# EAGLE schematic internal excitation- #7 (EAGLE 6.2)
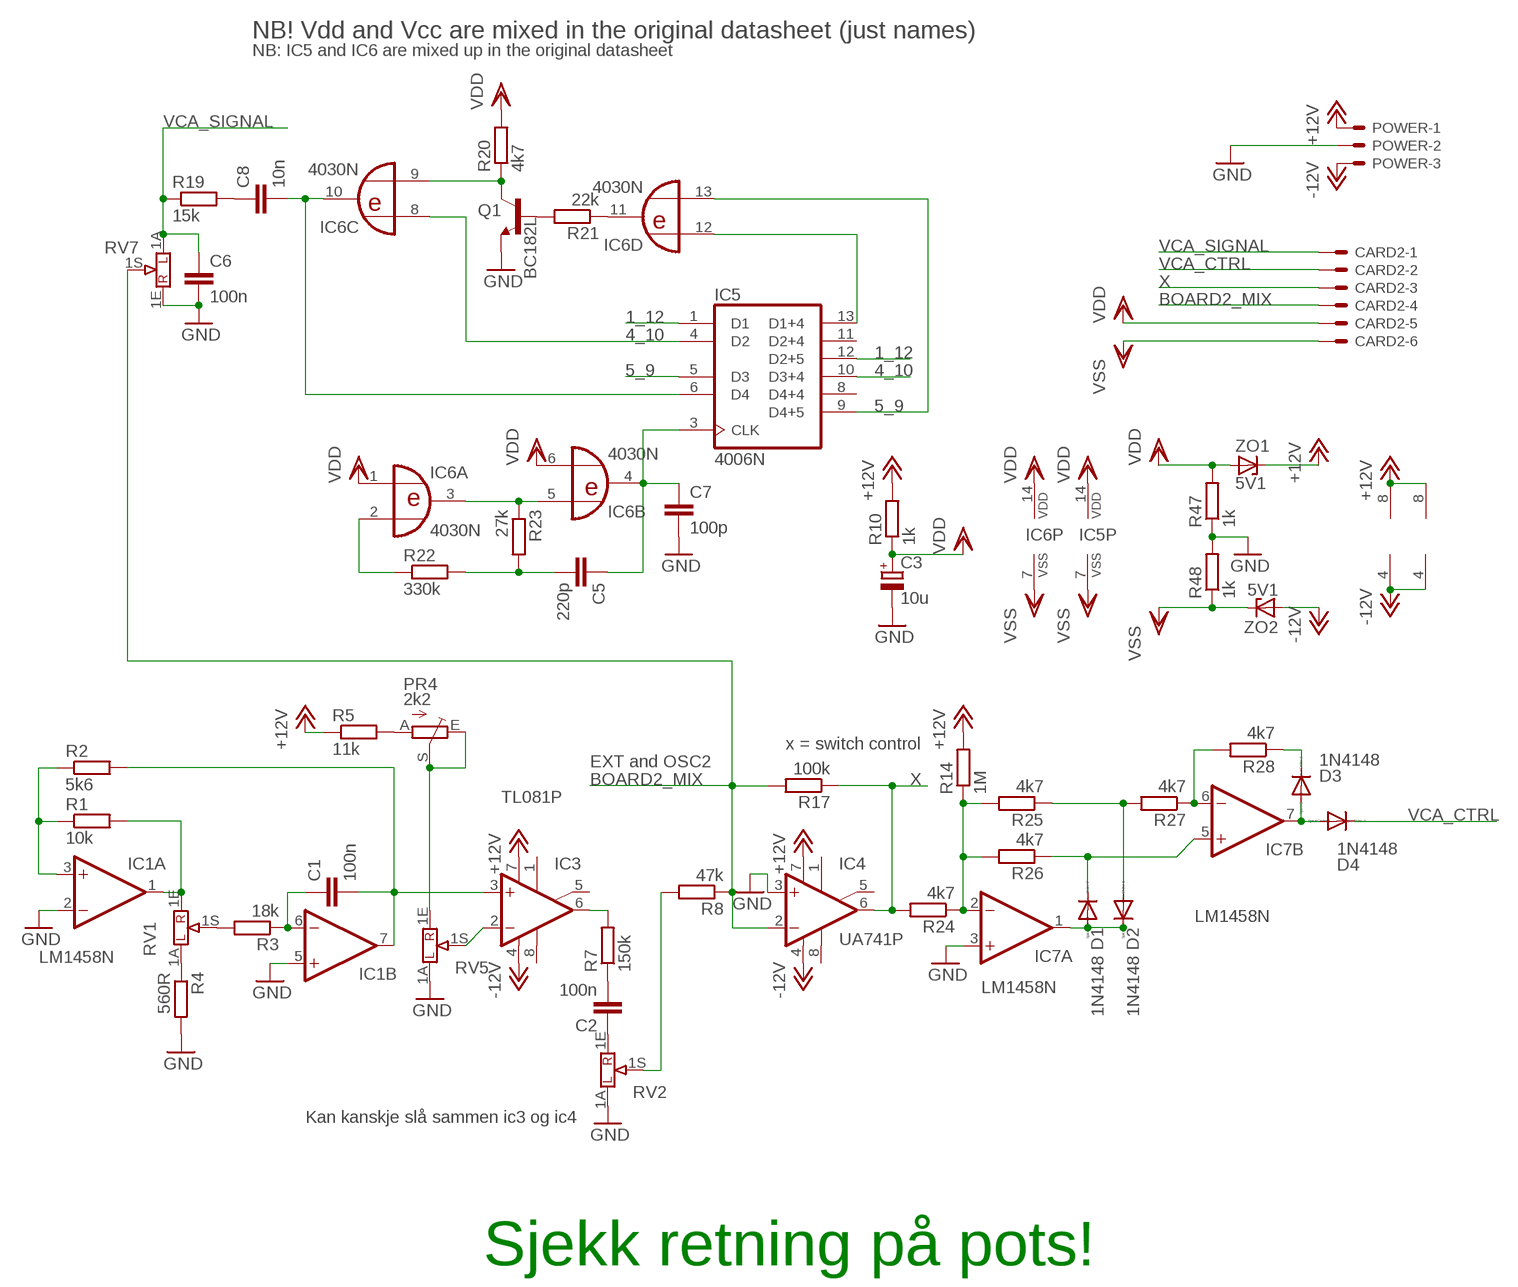
[diagram p0: schematic, sheet 1]

## Parts
C1  100n  C-EU050-025X075  [C050-025X075]
C2  100n  C-EU025-025X050  [C025-025X050]
C3  10u  CPOL-EUE2.5-5  [E2,5-5]
C5  220p  C-EU025-025X050  [C025-025X050]
C6  100n  C-EU025-025X050  [C025-025X050]
C7  100p  C-EU025-025X050  [C025-025X050]
C8  10n  C-EU050-025X075  [C050-025X075]
CARD2  22-23-2061  [22-23-2061]
D1  1N4148  1N4148DOJ35-5  [DO35-5J]
D2  1N4148  1N4148DOJ35-5  [DO35-5J]
D3  1N4148  1N4148DOJ35-5  [DO35-5J]
D4  1N4148  1N4148DOJ35-5  [DO35-5J]
IC1  LM1458N  [DIL08]
IC3  TL081P  [DIL08]
IC4  UA741P  [DIL08]
IC5  4006N  [DIL14]
IC6  4030N  [DIL14]
IC7  LM1458N  [DIL08]
POWER  KK-156-3  [KK-156-3]
PR4  2k2  TRIM_EU-CA9V  [CA9V]
Q1  BC182L  -NPN-TO92-ECB  [TO92-ECB]
R1  10k  R-EU_0207/7  [0207/7]
R2  5k6  R-EU_0207/7  [0207/7]
R3  18k  R-EU_0207/7  [0207/7]
R4  560R  R-EU_0207/7  [0207/7]
R5  11k  R-EU_0207/7  [0207/7]
R7  150k  R-EU_0207/7  [0207/7]
R8  47k  R-EU_0207/7  [0207/7]
R10  1k  R-EU_0207/7  [0207/7]
R14  1M  R-EU_0207/7  [0207/7]
R17  100k  R-EU_0207/7  [0207/7]
R19  15k  R-EU_0207/7  [0207/7]
R20  4k7  R-EU_0207/7  [0207/7]
R21  22k  R-EU_0207/7  [0207/7]
R22  330k  R-EU_0207/7  [0207/7]
R23  27k  R-EU_0207/7  [0207/7]
R24  4k7  R-EU_0207/7  [0207/7]
R25  4k7  R-EU_0207/7  [0207/7]
R26  4k7  R-EU_0207/7  [0207/7]
R27  4k7  R-EU_0207/7  [0207/7]
R28  4k7  R-EU_0207/7  [0207/7]
R47  1k  R-EU_0207/7  [0207/7]
R48  1k  R-EU_0207/7  [0207/7]
RV1  10k log  POT16_W_BRACKET""  [POT16_W_BRACKET]
RV2  10k log  POT16_W_BRACKET""  [POT16_W_BRACKET]
RV5  10k  POT16_W_BRACKET""  [POT16_W_BRACKET]
RV7  10k  POT16_W_BRACKET""  [POT16_W_BRACKET]
ZO1  5V1  ZENER-DIODEZD-5  [ZDIO-5]
ZO2  5V1  ZENER-DIODEZD-5  [ZDIO-5]

## Nets
1_12: IC5.1(D1) IC5.12(D2+5)
4_10: IC5.4(D2) IC5.10(D3+4) IC6.8(C:I0)
5_9: IC5.5(D3) IC5.9(D4+5) IC6.13(D:I1)
+12V: IC1.8(P:V+) IC3.7(V+) IC4.7(V+) IC7.8(P:V+) POWER.1 R5.1 R10.2 R14.2 ZO1.C
-12V: IC1.4(P:V-) IC3.4(V-) IC4.4(V-) IC7.4(P:V-) POWER.3 ZO2.A
BOARD2_MIX: CARD2.4 IC4.2(-IN) R8.1 R17.2 RV7.1S
GND: C3.- C6.2 C7.2 IC1.2(A:-IN) IC1.5(B:+IN) IC4.3(+IN) IC7.3(A:+IN) POWER.2 Q1.E R4.2 R47.1 R48.2 RV2.1A RV5.1A RV7.1E
N$1: IC1.3(A:+IN) R1.1 R2.1
N$2: IC1.1(A:OUT) R1.2 RV1.1E
N$3: R3.2 RV1.1S
N$4: C1.1 IC1.6(B:-IN) R3.1
N$5: R4.1 RV1.1A
N$6: C1.2 IC1.7(B:OUT) IC3.3(+IN) R2.2
N$7: IC3.2(-IN) RV5.1S
N$8: PR4.A R5.2
N$9: PR4.E PR4.S RV5.1E
N$10: IC3.6(OUT) R7.2
N$11: C2.2 R7.1
N$12: C2.1 RV2.1E
N$13: R8.2 RV2.1S
N$14: IC6.3(A:O) IC6.5(B:I0) R23.1
N$15: D1.A D2.C IC7.1(A:OUT)
N$16: IC7.2(A:-IN) R14.1 R24.1 R25.2 R26.2
N$17: D1.C IC7.5(B:+IN) R26.1
N$18: D2.A R25.1 R27.2
N$19: IC7.6(B:-IN) R27.1 R28.2
N$20: D3.C R28.1
N$21: D3.A D4.A IC7.7(B:OUT)
N$25: C8.1 R19.2
N$26: C8.2 IC5.6(D4) IC6.10(C:O)
N$27: IC6.9(C:I1) Q1.C R20.1
N$28: IC6.11(D:O) R21.1
N$29: IC6.2(A:I1) R22.1
N$30: C5.2 R22.2 R23.2
N$31: IC5.13(D1+4) IC6.12(D:I0)
N$32: C5.1 C7.1 IC5.3(CLK) IC6.4(B:O)
N$33: Q1.B R21.2
VCA_CTRL: CARD2.2 D4.C
VCA_SIGNAL: C6.1 CARD2.1 R19.1 RV7.1A
VDD: C3.+ CARD2.5 IC5.14(VDD) IC6.1(A:I0) IC6.6(B:I1) IC6.14(P:VDD) R10.1 R20.2 R47.2 ZO1.A
VSS: CARD2.6 IC5.7(VSS) IC6.7(P:VSS) R48.1 ZO2.C
X: CARD2.3 IC4.6(OUT) R17.1 R24.2
Unconnected: IC3.1(ON1) IC3.5(ON2) IC3.8(OPT) IC4.1(ON1) IC4.5(ON2) IC4.8(OPT) IC5.8(D4+4) IC5.11(D2+4) RV1.M1 RV1.M2 RV1.M3 RV1.M4 RV2.M1 RV2.M2 RV2.M3 RV2.M4 RV5.M1 RV5.M2 RV5.M3 RV5.M4 RV7.M1 RV7.M2 RV7.M3 RV7.M4

## Notes on the sheet
- NB! Vdd and Vcc are mixed in the original datasheet (just names)
- NB: IC5 and IC6 are mixed up in the original datasheet
- x = switch control
- EXT and OSC2
- Kan kanskje slå sammen ic3 og ic4
- Sjekk retning på pots!

## Library data of the parts
C1 C2 C5-C8 = resistor:C-EU: CAPACITOR, European symbol
C3 = resistor:CPOL-EU: POLARIZED CAPACITOR, European symbol
CARD2 = con-molex:22-23-2061: .100" (2.54mm) Center Header - 6 Pin; MF: MOLEX; MPN: 22-23-2061; OC_FARNELL: 1462922; OC_NEWARK: 27C1933
D1-D4 = joakim:1N4148: DIODE high speed (Philips)
IC1 IC7 = linear:*1458: OP AMP
IC3 = linear:TL081: OP AMP
IC4 = linear:*741: OP AMP
IC5 = 40xx:4006: 18-bit static SHIFT REGISTER
IC6 = 40xx:4030: Quad XOR
POWER = con-molex:KK-156-3: KK 156 HEADER Source: http://www.molex.com/pdm_docs/sd/026604100_sd.pdf; OC_FARNELL: unknown; OC_NEWARK: unknown
PR4 = pot:TRIM_EU-: POTENTIOMETER
Q1 = transistor:*-NPN-: NPN Transistror BF959 corrected 2008.03.06
R1-R5 R7 R8 R10 R14 R17 R19-R28 R47 R48 = resistor:R-EU_: RESISTOR, European symbol
RV1 RV2 RV5 RV7 = joakim:POT16_W_BRACKET: POTENTIOMETER potentiometer, 16 mm w 5mm pitch and OMEG bracket, 17,8 x 7,5 mm
ZO1 ZO2 = diode:ZENER-DIODE: Z-Diode